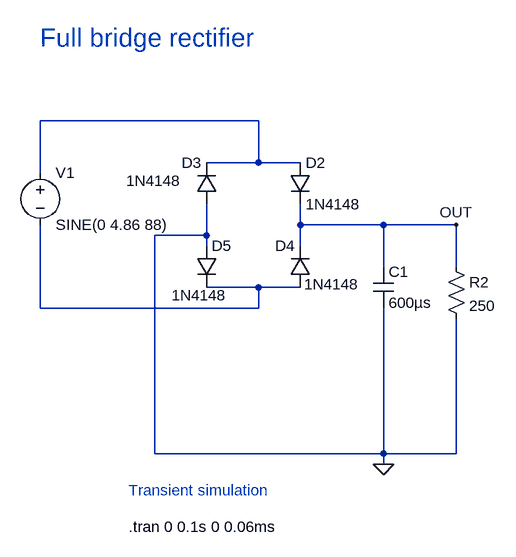
[diagram p0: schematic Full-bridge-rectifier.asc]
Full-bridge-rectifier.asc, the LTspice schematic file:
Version 4.1
SHEET 1 916 680
WIRE 416 16 80 16
WIRE 416 80 416 16
WIRE 416 80 336 80
WIRE 480 80 416 80
WIRE 80 96 80 16
WIRE 480 176 480 144
WIRE 608 176 480 176
WIRE 720 176 608 176
WIRE 336 192 336 144
WIRE 336 192 256 192
WIRE 336 208 336 192
WIRE 480 208 480 176
WIRE 608 240 608 176
WIRE 720 240 720 176
WIRE 416 272 336 272
WIRE 480 272 416 272
WIRE 80 304 80 176
WIRE 416 304 416 272
WIRE 416 304 80 304
WIRE 256 528 256 192
WIRE 608 528 608 304
WIRE 608 528 256 528
WIRE 720 528 720 320
WIRE 720 528 608 528
WIRE 608 544 608 528
FLAG 608 544 0
FLAG 720 176 OUT
SYMBOL voltage 80 80 R0
WINDOW 123 0 0 Left 2
WINDOW 39 0 0 Left 2
SYMATTR InstName V1
SYMATTR Value SINE(0 4.86 88)
SYMBOL diode 464 80 R0
SYMATTR InstName D2
SYMATTR Value 1N4148
SYMBOL diode 352 144 R180
WINDOW 0 24 64 Left 2
WINDOW 3 55 36 Left 2
SYMATTR InstName D3
SYMATTR Value 1N4148
SYMBOL diode 496 272 R180
WINDOW 0 24 64 Left 2
WINDOW 3 -75 5 Left 2
SYMATTR InstName D4
SYMATTR Value 1N4148
SYMBOL diode 320 208 R0
WINDOW 3 -38 76 Left 2
SYMATTR Value 1N4148
SYMATTR InstName D5
SYMBOL res 704 224 R0
SYMATTR InstName R2
SYMATTR Value 250
SYMBOL cap 592 240 R0
SYMATTR InstName C1
SYMATTR Value 600µs
TEXT 216 640 Left 2 !.tran 0 0.1s 0 0.06ms
TEXT 80 -112 Left 4 ;Full bridge rectifier
TEXT 216 584 Left 2 ;Transient simulation

The netlist it stands for:
* Full-bridge-rectifier.asc
V1 N001 N002 SINE(0 4.86 88)
D2 N001 OUT 1N4148
D3 0 N001 1N4148
D4 N002 OUT 1N4148
D5 0 N002 1N4148
R2 OUT 0 250
C1 OUT 0 600µs
.model D D
.lib standard.dio
.tran 0 0.1s 0 0.06ms
* Full bridge rectifier
* Transient simulation
.backanno
.end